# Altium schematic sheet BMS AFE - Thermistors.SchDoc: Title
size B; Organization: Midnight Sun Solar Rayce Car Team; Address1: University of Waterloo; Address2: 200 University Ave W; Address3: Waterloo, ON, Canada; Address4: N2L 3E9; DocumentNumber: 7; SheetNumber: 7; SheetTotal: 7; Website: www.uwmidsun.com; ProjectName: ProjectName
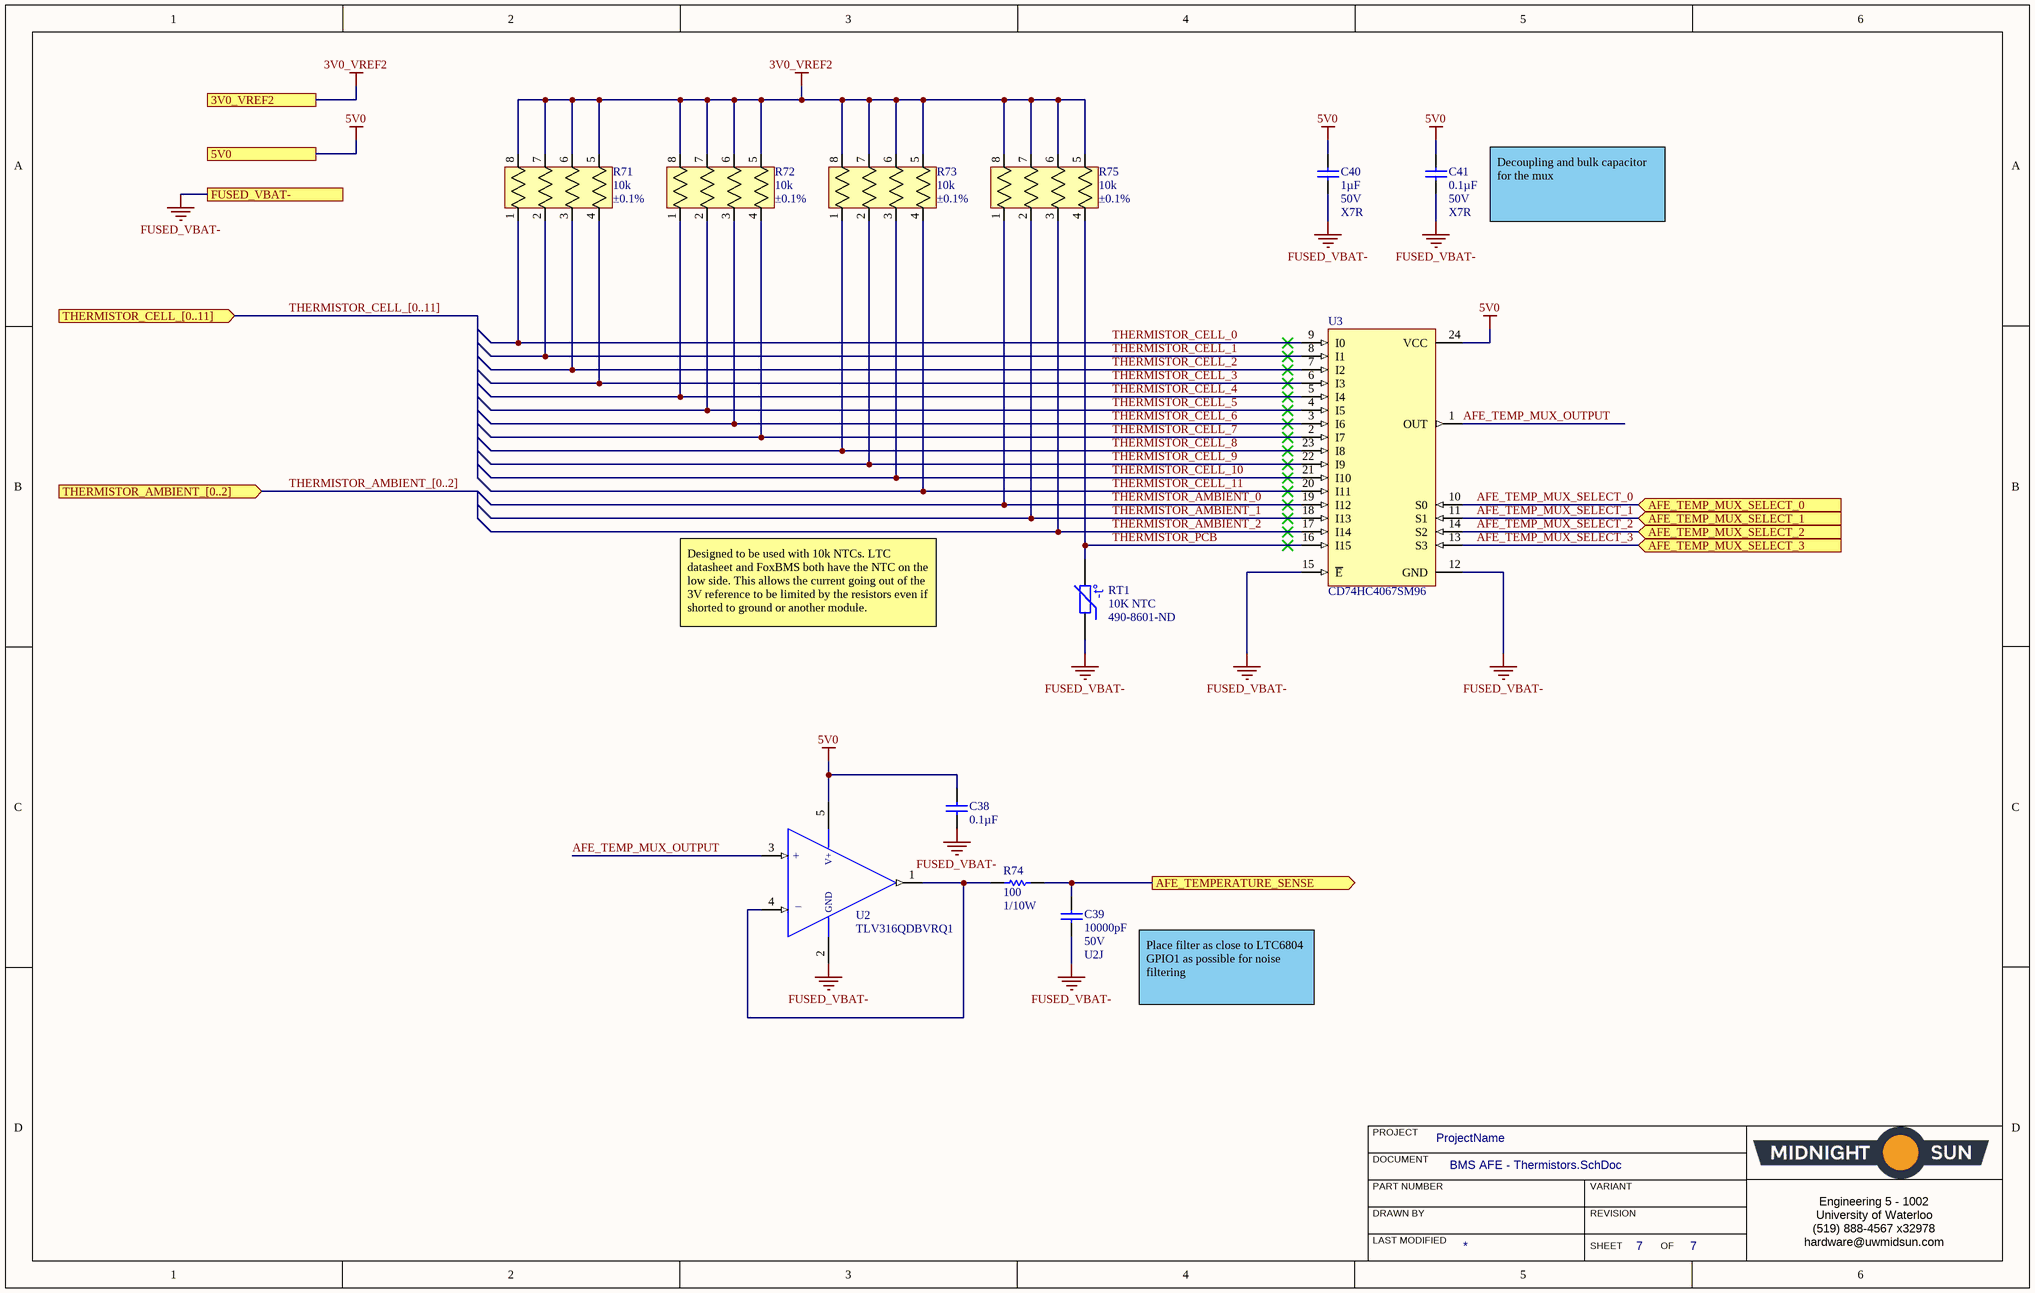
[diagram p0: BMS AFE - Thermistors.SchDoc]

## Parts
C38  Capacitance: 0.1µF  [CAP, 0603]  (hidden comment: CAP CER 0.1UF 50V 10% X7R 0603)
C39  Capacitance: 10000pF  Voltage: 50V  Temperature Coefficient: U2J  [CAP, 0603]  (hidden comment: CAP CER 10nF 50V 5% X7R 0603)
C40  Capacitance: 1µF  Voltage: 50V  Temperature Coefficient: X7R  [CAP, 0603]  (hidden comment: CAP CER 1UF 50V 10% X7R 0603)
C41  Capacitance: 0.1µF  Voltage: 50V  Temperature Coefficient: X7R  [CAP, 0603]  (hidden comment: CAP CER 0.1UF 50V 10% X7R 0603)
R71  Resistance (Ohms): 10k  Tolerance: ±0.1%  [RES ARRAY 4RES 1206]  (hidden comment: RES ARRAY 10K OHM 0.1% 4RES 1206)
R72  Resistance (Ohms): 10k  Tolerance: ±0.1%  [RES ARRAY 4RES 1206]  (hidden comment: RES ARRAY 10K OHM 0.1% 4RES 1206)
R73  Resistance (Ohms): 10k  Tolerance: ±0.1%  [RES ARRAY 4RES 1206]  (hidden comment: RES ARRAY 10K OHM 0.1% 4RES 1206)
R74  Resistance: 100  Power: 1/10W  [RES, 0603]  (hidden comment: RES 100 OHM 1% 1/10W 0603)
R75  Resistance (Ohms): 10k  Tolerance: ±0.1%  [RES ARRAY 4RES 1206]  (hidden comment: RES ARRAY 10K OHM 0.1% 4RES 1206)
RT1  10K NTC  Supplier Part Number 1: 490-8601-ND  [NTC THERMISTOR BEAD]
U2  Manufacturer Part Number 1: TLV316QDBVRQ1  [IC OP AMP GP RR 10MHZ SOT-23-5]  (hidden comment: IC OP AMP GEN PURPOSE RR 10MHZ SOT-23-5)
U3  Manufacturer Part Number 1: CD74HC4067SM96  [SOP127P1030X265-24N]  (hidden comment: IC MUX/DEMUX 1X16 24SSOP)

## Ports
3V0_VREF2, 5V0, AFE_TEMP_MUX_SELECT_0 (in), AFE_TEMP_MUX_SELECT_1 (in), AFE_TEMP_MUX_SELECT_2 (in), AFE_TEMP_MUX_SELECT_3 (in), AFE_TEMPERATURE_SENSE (out), FUSED_VBAT-, THERMISTOR_AMBIENT_[0..2] (in), THERMISTOR_CELL_[0..11] (in)

## Nets
3V0_VREF2: R71.5 R71.6 R71.7 R71.8 R72.5 R72.6 R72.7 R72.8 R73.5 R73.6 R73.7 R73.8 R75.5 R75.6 R75.7 R75.8 ; port 3V0_VREF2
5V0: C38.1 C40.1 C41.1 U2.5(VDD) U3.24(VCC) ; port 5V0
FUSED_VBAT-: C38.2 C39.2 C40.2 C41.2 RT1.1 U2.2(VSS) U3.12(GND) U3.15(~{E}) ; port FUSED_VBAT-
AFE_TEMP_MUX_OUTPUT: U2.3(+IN) U3.1(OUT)
AFE_TEMP_MUX_SELECT_0: U3.10(S0) ; port AFE_TEMP_MUX_SELECT_0
AFE_TEMP_MUX_SELECT_1: U3.11(S1) ; port AFE_TEMP_MUX_SELECT_1
AFE_TEMP_MUX_SELECT_2: U3.14(S2) ; port AFE_TEMP_MUX_SELECT_2
AFE_TEMP_MUX_SELECT_3: U3.13(S3) ; port AFE_TEMP_MUX_SELECT_3
AFE_TEMPERATURE_SENSE: C39.1 R74.2 ; port AFE_TEMPERATURE_SENSE
THERMISTOR_AMBIENT_0: R75.1 U3.19(I12)
THERMISTOR_AMBIENT_1: R75.2 U3.18(I13)
THERMISTOR_AMBIENT_2: R75.3 U3.17(I14)
THERMISTOR_CELL_0: R71.1 U3.9(I0)
THERMISTOR_CELL_1: R71.2 U3.8(I1)
THERMISTOR_CELL_2: R71.3 U3.7(I2)
THERMISTOR_CELL_3: R71.4 U3.6(I3)
THERMISTOR_CELL_4: R72.1 U3.5(I4)
THERMISTOR_CELL_5: R72.2 U3.4(I5)
THERMISTOR_CELL_6: R72.3 U3.3(I6)
THERMISTOR_CELL_7: R72.4 U3.2(I7)
THERMISTOR_CELL_8: R73.1 U3.23(I8)
THERMISTOR_CELL_9: R73.2 U3.22(I9)
THERMISTOR_CELL_10: R73.3 U3.21(I10)
THERMISTOR_CELL_11: R73.4 U3.20(I11)
THERMISTOR_PCB: R75.4 RT1.2 U3.16(I15)
NetR74_1: R74.1 U2.1(OUTPUT) U2.4(-IN)

## Buses and harness runs
bus THERMISTOR_AMBIENT_[0..2] = port THERMISTOR_AMBIENT_[0..2]
bus THERMISTOR_CELL_[0..11] = port THERMISTOR_CELL_[0..11]

## Notes on the sheet
- Decoupling and bulk capacitor for the mux
- Designed to be used with 10k NTCs. LTC datasheet and FoxBMS both have the NTC on the low side. This allows the current going out of the 3V reference to be limited by the resistors even if shorted to ground or another module.
- Place filter as close to LTC6804 GPIO1 as possible for noise filtering
- PROJECT
- DOCUMENT
- DRAWN BY
- LAST MODIFIED
- PART NUMBER
- REVISION
- SHEET
- VARIANT
- OF
- Engineering 5 - 1002
  University of Waterloo
  (519) 888-4567 x32978
  hardware@uwmidsun.com
- (in symbol IC OP AMP GEN PURPOSE RR 10MHZ SOT-23-5) V+; +; GND; _
- (in symbol NTC THERMISTOR 10K 1% BEAD) -t°

## Library data of the parts
C38 C41 = CAP CER 0.1UF 50V 10% X7R 0603: 0.10µF ±10% 50V Ceramic Capacitor X7R 0603 (1608 Metric); Manufacturer 1: AVX Corporation; Manufacturer Part Number 1: 06035C104KAT2A; Supplier 1: Digi-Key; Supplier Part Number 1: 478-5052-1-ND; Packaging: Cut Tape (CT); Part Status: Active; Operating Temperature: -55°C ~ 125°C; Ratings: -; Mounting Type: Surface Mount, MLCC; Package / Case: 0603 (1608 Metric); Size / Dimension: 0.063" L x 0.032" W (1.60mm x 0.81mm); Height - Seated (Max): -; Thickness (Max): 0.035" (0.90mm); Lead Spacing: -; Lead Style: -; ComponentLink1URL: http://datasheets.avx.com/X7RDielectric.pdf; ComponentLink1Description: http://datasheets.avx.com/X7RDielectric.pdf; Tolerance: ±10%
  C38: Voltage: 50V; Temperature Coefficient: X7R
C39 = CAP CER 10nF 50V 5% X7R 0603: 10000pF ±5% 50V Ceramic Capacitor U2J 0603 (1608 Metric); Manufacturer 1: KEMET; Manufacturer Part Number 1: C0603C103J5JAC7867; Supplier 1: Digi-Key; Supplier Part Number 1: 399-13384-1-ND; Packaging: Cut Tape (CT); Part Status: Active; Operating Temperature: -55°C ~ 125°C; Ratings: -; Failure Rate: -; Mounting Type: Surface Mount, MLCC; Package / Case: 0603 (1608 Metric); Size / Dimension: 0.063" L x 0.032" W (1.60mm x 0.80mm); Height - Seated (Max): -; Thickness (Max): 0.034" (0.87mm); Lead Spacing: -; Lead Style: -; ComponentLink1URL: http://www.kemet.com/docfinder?Partnumber=C0603C103J5JAC7867; ComponentLink1Description: http://www.kemet.com/docfinder?Partnumber=C0603C103J5JAC7867; Tolerance: ±5%
C40 = CAP CER 1UF 50V 10% X7R 0603: 1µF ±10% 50V Ceramic Capacitor X7R 0603 (1608 Metric); Manufacturer 1: Taiyo Yuden; Manufacturer Part Number 1: UMK107AB7105KA-T; Supplier 1: Digi-Key; Supplier Part Number 1: 587-3247-1-ND; Packaging: Cut Tape (CT); Part Status: Active; Operating Temperature: -55°C ~ 125°C; Ratings: -; Mounting Type: Surface Mount, MLCC; Package / Case: 0603 (1608 Metric); Size / Dimension: 0.063" L x 0.031" W (1.60mm x 0.80mm); Height - Seated (Max): -; Thickness (Max): 0.037" (0.95mm); Lead Spacing: -; Lead Style: -; ComponentLink1URL: http://www.yuden.co.jp/productdata/catalog/en/mlcc_all_e.pdf; ComponentLink1Description: http://www.yuden.co.jp/productdata/catalog/en/mlcc_all_e.pdf; Tolerance: ±10%
R71-R73 R75 = RES ARRAY 10K OHM 0.1% 4RES 1206: 10k Ohm ±0.1% 100mW Power Per Element Isolated 4 Resistor Network/Array ±25ppm/°C 1206 (3216 Metric), Convex, Long Side Terminals; Manufacturer: Vishay Beyschlag; Manufacturer Part Number: ACASA1002S1002P100; Number of Resistors: 4; Resistor Matching Ratio: ±0.05%; Resistor-Ratio-Drift: ±15 ppm/°C; Supplier 1: Digi-Key; RoHS: RoHS Compliant; Category: Resistors; Stock 1: 18780; Pricing 1: 1=1.19, 10=0.99, 25=0.8484, 50=0.7636, 100=0.6647, 250=0.59392, 500=0.4808 (CAD); Packaging: Cut Tape (CT); Part Status: Active; Circuit Type: Isolated; Power Per Element: 100mW; Temperature Coefficient: ±25ppm/°C; Operating Temperature: -55°C ~ 125°C; Applications: Voltage Divider (TCR Matched); Mounting Type: Surface Mount; Package / Case: 1206 (3216 Metric), Convex, Long Side Terminals; Supplier Device Package: 0612; Size / Dimension: 0.126" L x 0.059" W (3.20mm x 1.50mm); Height - Seated (Max): 0.022" (0.55mm); ComponentLink1URL: http://www.vishay.com/docs/28751/acasprec.pdf; ComponentLink1Description: http://www.vishay.com/docs/28751/acasprec.pdf; Supplier Part Number 1: 749-1023-1-ND
R74 = RES 100 OHM 1% 1/10W 0603: 100 Ohm ±1% 0.1W, 1/10W Chip Resistor 0603 (1608 Metric) Moisture Resistant Thick Film; Manufacturer 1: Yageo; Manufacturer Part Number 1: RC0603FR-07100RL; Temperature Coefficient: ±100ppm/°C; Supplier 1: Digi-Key; Supplier Part Number 1: 311-100HRCT-ND; Packaging: Cut Tape (CT); Part Status: Active; Composition: Thick Film; Operating Temperature: -55°C ~ 155°C; Package / Case: 0603 (1608 Metric); Supplier Device Package: 0603; Size / Dimension: 0.063" L x 0.031" W (1.60mm x 0.80mm); Height - Seated (Max): 0.022" (0.55mm); Failure Rate: -; ComponentLink1URL: http://www.yageo.com/documents/recent/PYu-RC_Group_51_RoHS_L_7.pdf; ComponentLink1Description: http://www.yageo.com/documents/recent/PYu-RC_Group_51_RoHS_L_7.pdf; Tolerance: ±1%
RT1 = NTC THERMISTOR 10K 1% BEAD: NTC Thermistor 10k Bead; Manufacturer: Murata Electronics North America; Manufacturer Part Number: NXRT15XH103FA1B030; Resistance Tolerance: ±1%; B25/50: 3380K; B25/85: 3434K; B25/100: 3455K; Supplier 1: Digi-Key; RoHS: RoHS Compliant; Category: Sensors, Transducers; Stock 1: 25017; Pricing 1: 1=0.96, 5=0.91, 10=0.792, 25=0.696, 50=0.5784, 100=0.4925, 500=0.42834, 1000=0.3748, 5000=0.33197 (CAD); Packaging: Bulk; Part Status: Active; Resistance in Ohms @ 25°C: 10k; B Value Tolerance: ±1%; B0/50: -; B25/75: -; Operating Temperature: -40°C ~ 125°C; Length - Lead Wire: -; Mounting Type: Through Hole; Package / Case: Bead; ComponentLink1URL: https://www.murata.com/~/media/webrenewal/support/library/catalog/products/thermistor/ntc/r44e.ashx; ComponentLink1Description: https://www.murata.com/~/media/webrenewal/support/library/catalog/products/thermistor/ntc/r44e.ashx
U2 = IC OP AMP GEN PURPOSE RR 10MHZ SOT-23-5: General Purpose Amplifier 1 Circuit Rail-to-Rail SOT-23-5; Manufacturer 1: Texas Instruments; Description 1: IC OP AMP GP RR 10MHZ 5-SOT-23; Number of Circuits: 1; Slew Rate: 6 V/µs; Current - Supply: 400µA; Current - Output / Channel: 50mA; Voltage - Supply, Single/Dual (±): 1.8 V ~ 5.5 V, ±0.9 V ~ 2.75 V; Supplier 1: Digi-Key; Supplier Part Number 1: 296-45323-1-ND; RoHS: RoHS Compliant; Category: Integrated Circuits (ICs); Stock 1: 1747; Pricing 1: 1=1.33, 10=1.185, 100=0.9234, 500=0.76276, 1000=0.60218 (CAD); Packaging: Cut Tape (CT); Part Status: Active; Amplifier Type: General Purpose; Output Type: Rail-to-Rail; -3db Bandwidth: -; Operating Temperature: -40°C ~ 125°C; Mounting Type: Surface Mount; Package / Case: SC-74A, SOT-753; Supplier Device Package: SOT-23-5; ComponentLink1URL: http://www.ti.com/lit/ds/symlink/tlv316-q1.pdf; ComponentLink1Description: http://www.ti.com/lit/ds/symlink/tlv316-q1.pdf
U3 = IC MUX/DEMUX 1X16 24SSOP: 1 Circuit IC Switch 16:1 160 Ohm 24-SSOP; Manufacturer 1: Texas Instruments; Number of Circuits: 1; On-State Resistance (Max): 160 Ohm; Channel-to-Channel Matching (&Delta;Ron): 8.5 Ohm; Voltage - Supply, Single (V+): 2 V ~ 6 V; Switch Time (Ton, Toff) (Max): 51ns, 49ns; -3db Bandwidth: 89MHz; Channel Capacitance (CS(off), CD(off)): 5pF, 50pF; Current - Leakage (IS(off)) (Max): 800nA; Supplier 1: Digi-Key; Supplier Part Number 1: 296-9226-1-ND; Packaging: Cut Tape (CT); Part Status: Active; Switch Circuit: -; Multiplexer/Demultiplexer Circuit: 16:1; Voltage - Supply, Dual (V±): -; Charge Injection: -; Crosstalk: -; Operating Temperature: -55°C ~ 125°C (TA); Package / Case: 24-SSOP (0.209", 5.30mm Width); Supplier Device Package: 24-SSOP; ComponentLink1URL: http://www.ti.com/lit/ds/symlink/cd74hc4067.pdf; ComponentLink1Description: http://www.ti.com/lit/ds/symlink/cd74hc4067.pdf